# Altium project PCB_Project1.PrjPCB
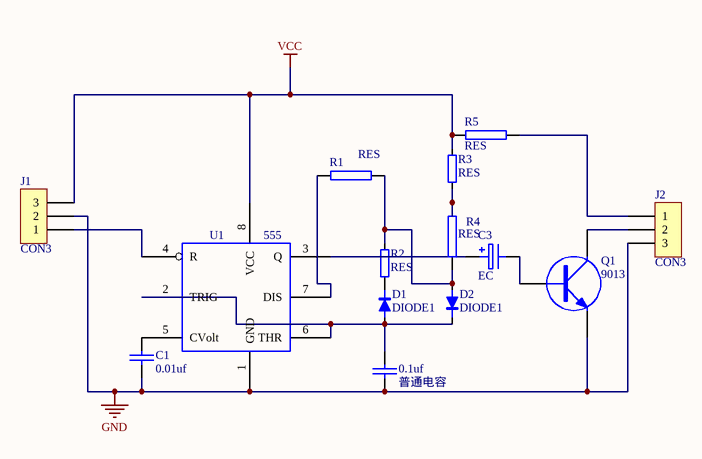
[diagram p0: Sheet1.SchDoc]
1 sheet, 14 parts. Net scope: global (net labels, ports and power ports of the same name join across sheets).
Board file: PCB1.PcbDoc

## Sheet Sheet1.SchDoc
size A4

### Parts
0.1uf  普通电容  [RAD0.2]
C1  0.01uf  [RAD0.2]
C3  EC  [RB.1/.2]
D1  DIODE1  [DIODE0.4A]
D2  DIODE1  [DIODE0.4A]
J1  CON3  [SIP3]
J2  CON3  [SIP3]
Q1  9013  [901#]
R1  RES  [AXIAL0.5]
R2  RES  [AXIAL0.5]
R3  RES  [AXIAL0.5]
R4  RES  [AXIAL0.5]
R5  RES  [AXIAL0.5]
U1  555  [DIP-8]

### Nets
GND: 0.1uf.2 C1.2 J1.2 J2.3 Q1.1(E) U1.1(GND)
VCC: J1.3 R3.2 R5.1 U1.8(VCC)
Net0.1uf_1: 0.1uf.1 D1.A D2.K U1.2(TRIG) U1.6(THR)
NetC1_1: C1.1 U1.5(CVolt)
NetC3_1: C3.1 U1.3(Q)
NetC3_2: C3.2(E) Q1.2(B)
NetD1_K: D1.K R2.1
NetD2_A: D2.A R1.2 R2.2 R4.1
NetJ1_1: J1.1 U1.4(R)
NetJ2_1: J2.1 R5.2
NetJ2_2: J2.2 Q1.3(C)
NetR1_1: R1.1 U1.7(DIS)
NetR3_1: R3.1 R4.2

### Library data of the parts
0.1uf C1 = 普通电容: Capacitor
Q1 = NPN9013